# Altium schematic sheet Pedal_Filters.SchDoc
size A2; SheetNumber: 1; SheetTotal: 2
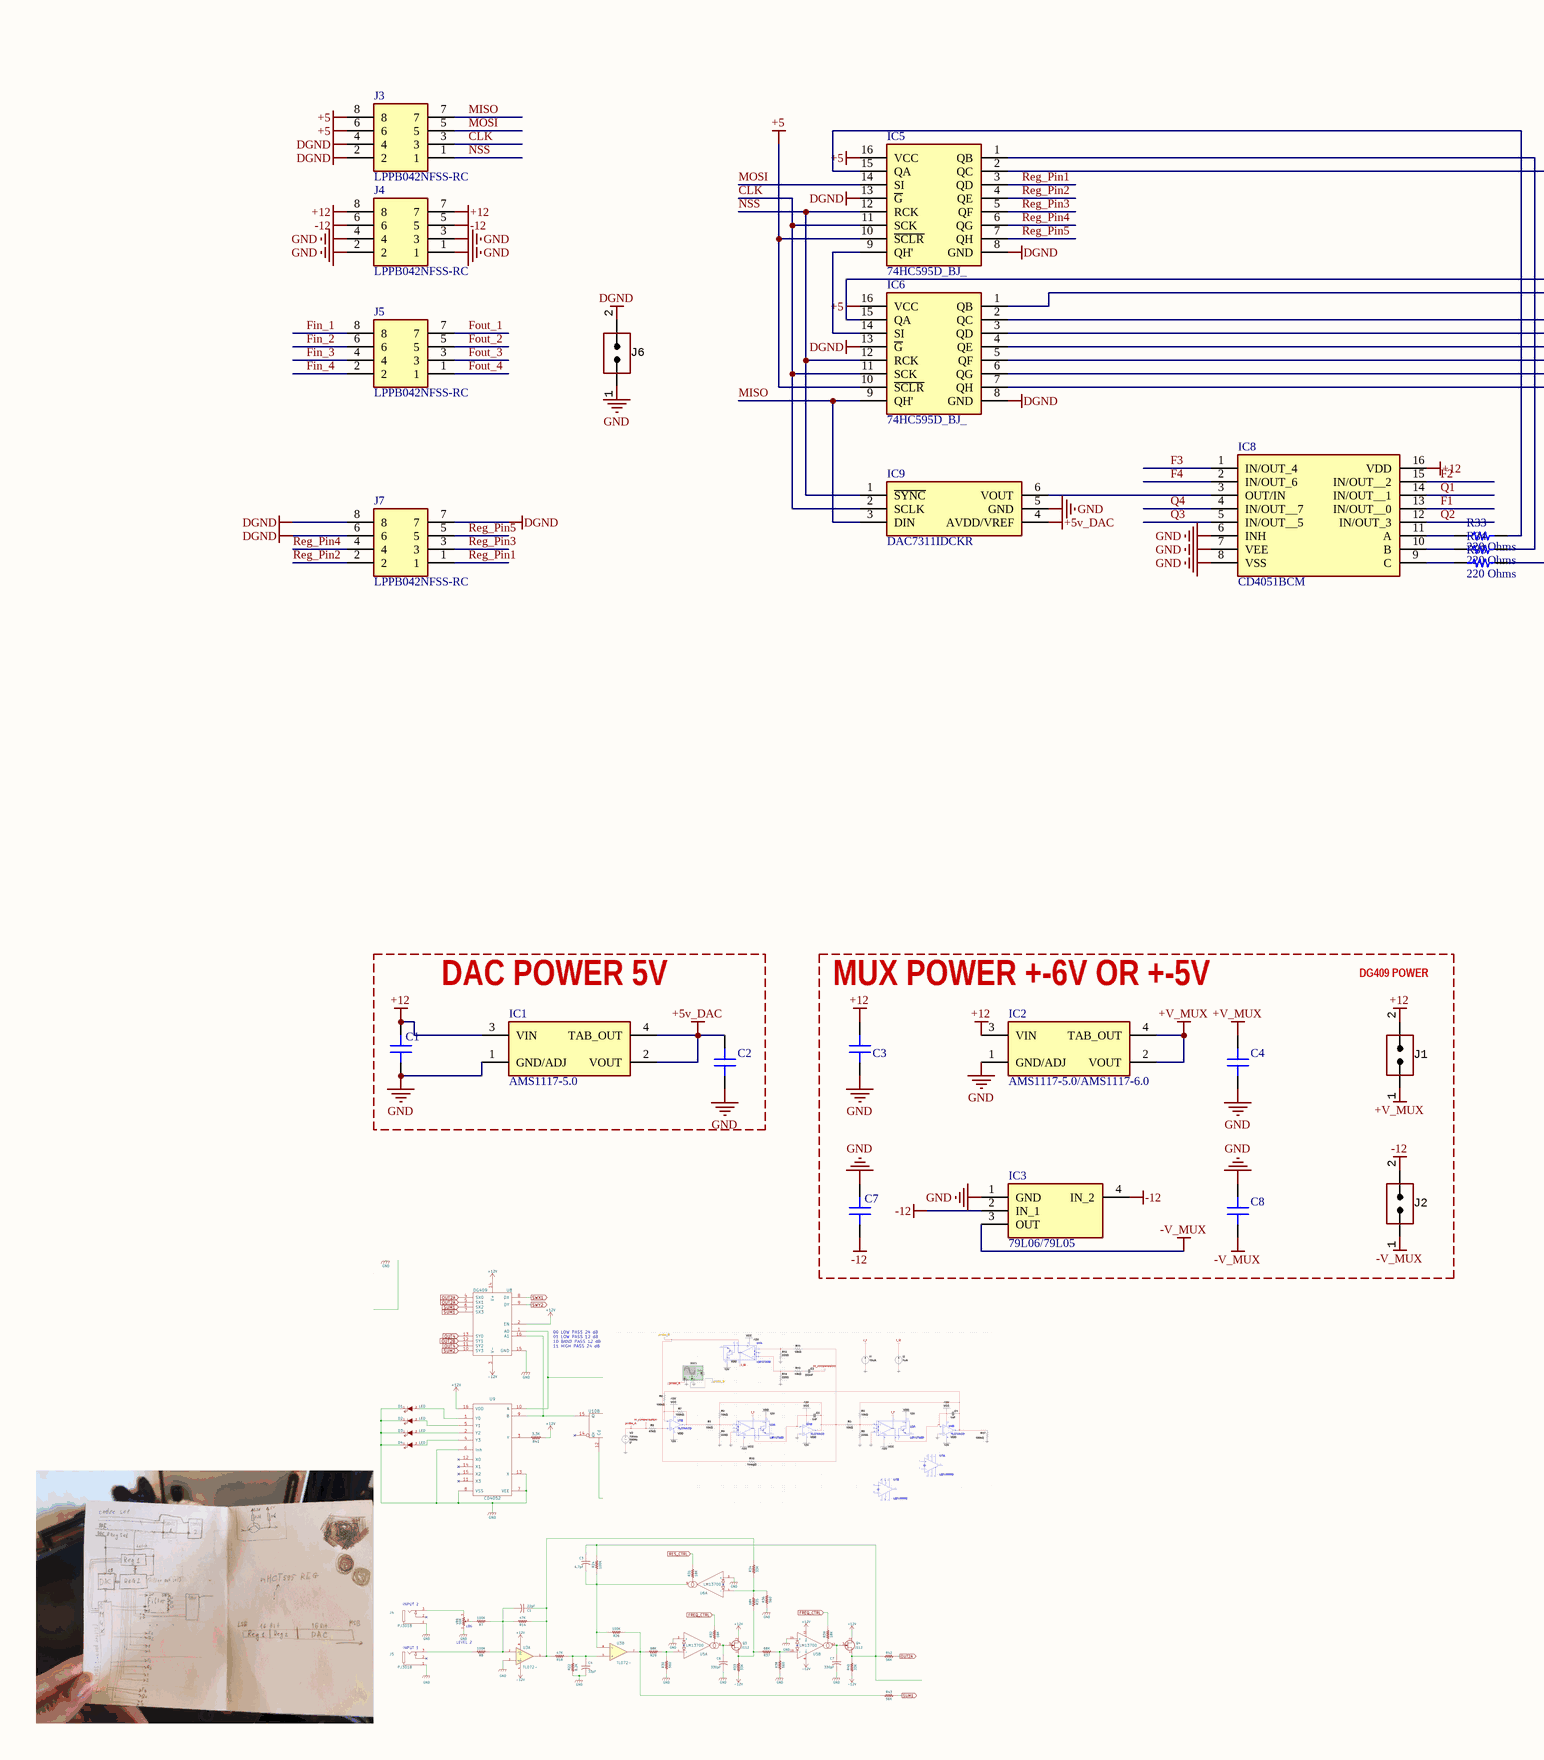
[diagram p0: Pedal_Filters.SchDoc, left]
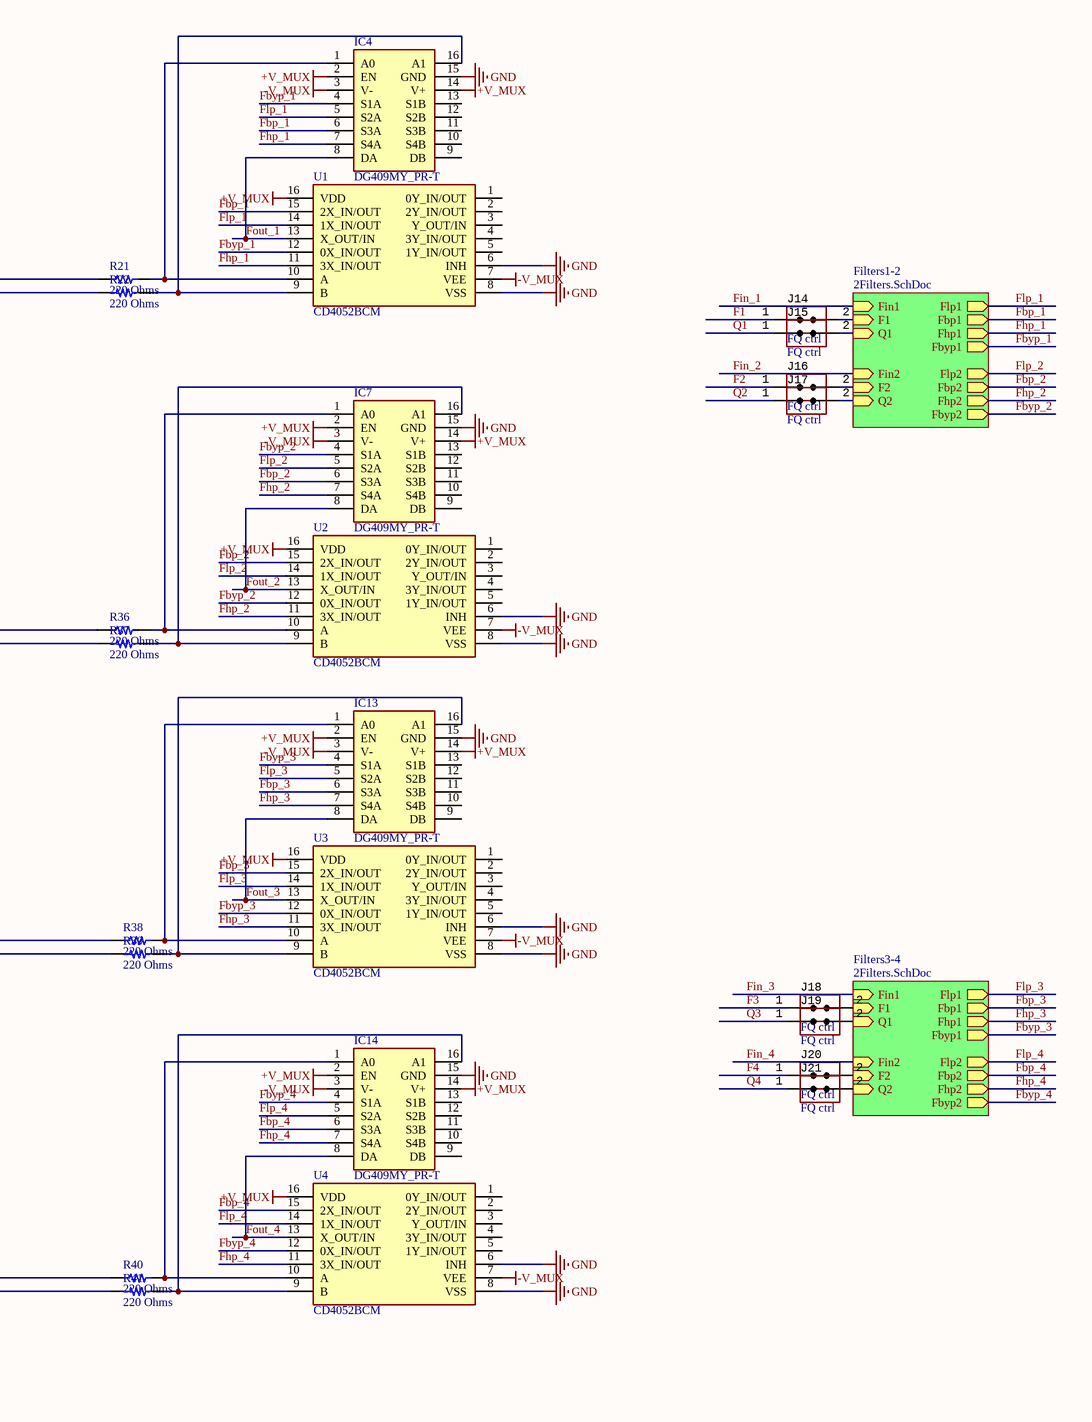
[diagram p1: Pedal_Filters.SchDoc, right]

## Parts
C1  (no value)  [CAP 0805_2012]
C2  (no value)  [CAP 0805_2012]
C3  (no value)  [CAP 0805_2012]
C4  (no value)  [CAP 0805_2012]
C7  (no value)  [CAP 0805_2012]
C8  (no value)  [CAP 0805_2012]
IC1  AMS1117-5.0  [SOT-223]
IC2  AMS1117-5.0/AMS1117-6.0  [SOT-223]
IC3  79L06/79L05  [79L06]
IC4  DG409MY_PR-T  [SOIC127P600X175-16N]
IC5  74HC595D_BJ_  [SOIC127P600X175-16N]
IC6  74HC595D_BJ_  [SOIC127P600X175-16N]
IC7  DG409MY_PR-T  [SOIC127P600X175-16N]
IC8  CD4051BCM  [SOIC127P599X175-16N]
IC9  DAC7311IDCKR  [SOT65P210X110-6N]
IC13  DG409MY_PR-T  [SOIC127P600X175-16N]
IC14  DG409MY_PR-T  [SOIC127P600X175-16N]
J1  V_MUX = 12V  [CON: JUMPER x1]  (value not drawn)
J2  V_MUX = 12V  [CON: JUMPER x1]  (value not drawn)
J3  LPPB042NFSS-RC  [LPPB042NFSSRC]
J4  LPPB042NFSS-RC  [LPPB042NFSSRC]
J5  LPPB042NFSS-RC  [LPPB042NFSSRC]
J6  (no value)  [CON: JUMPER x1]
J7  LPPB042NFSS-RC  [LPPB042NFSSRC]
J14  FQ ctrl  [CON: JUMPER x1]
J15  FQ ctrl  [CON: JUMPER x1]
J16  FQ ctrl  [CON: JUMPER x1]
J17  FQ ctrl  [CON: JUMPER x1]
J18  FQ ctrl  [CON: JUMPER x1]
J19  FQ ctrl  [CON: JUMPER x1]
J20  FQ ctrl  [CON: JUMPER x1]
J21  FQ ctrl  [CON: JUMPER x1]
R21  220 Ohms  [RES 0603_1608]
R22  220 Ohms  [RES 0603_1608]
R33  220 Ohms  [RES 0603_1608]
R34  220 Ohms  [RES 0603_1608]
R35  220 Ohms  [RES 0603_1608]
R36  220 Ohms  [RES 0603_1608]
R37  220 Ohms  [RES 0603_1608]
R38  220 Ohms  [RES 0603_1608]
R39  220 Ohms  [RES 0603_1608]
R40  220 Ohms  [RES 0603_1608]
R41  220 Ohms  [RES 0603_1608]
U1  CD4052BCM  [SOIC127P599X175-16N]
U2  CD4052BCM  [SOIC127P599X175-16N]
U3  CD4052BCM  [SOIC127P599X175-16N]
U4  CD4052BCM  [SOIC127P599X175-16N]

## Blocks framed on the sheet
DAC POWER 5V: C1 C2 IC1
MUX POWER +-6V OR +-5V: C3 C4 C7 C8 IC2 IC3 J1 J2

## Sub-sheets
Filters1-2 = 2Filters.SchDoc: Flp1 (out), Fbp1 (out), Fhp1 (out), Fbyp1 (out), Flp2 (out), Fbp2 (out), Fhp2 (out), Fbyp2 (out), Fin2 (in), Fin1 (in), F1 (in), Q1 (in), F2 (in), Q2 (in)
Filters3-4 = 2Filters.SchDoc: Flp1 (out), Fbp1 (out), Fhp1 (out), Fbyp1 (out), Flp2 (out), Fbp2 (out), Fhp2 (out), Fbyp2 (out), F1 (in), Q1 (in), Fin1 (in), Fin2 (in), F2 (in), Q2 (in)

## Nets
+5: IC5.10(~{SCLR}) IC5.16(VCC) IC6.10(~{SCLR}) IC6.16(VCC) J3.6 J3.8
+5v_DAC: C2.2 IC1.2(VOUT) IC1.4(TAB_OUT) IC9.4(AVDD/VREF)
+12: C1.2 C3.1 IC1.3(VIN) IC2.3(VIN) IC8.16(VDD) J1.2(IN) J4.7 J4.8
+V_MUX: C4.2 IC2.2(VOUT) IC2.4(TAB_OUT) IC4.2(EN) IC4.14(V+) IC7.2(EN) IC7.14(V+) IC13.2(EN) IC13.14(V+) IC14.2(EN) IC14.14(V+) J1.1(IN) U1.16(VDD) U2.16(VDD) U3.16(VDD) U4.16(VDD)
-12: C7.1 IC3.2(IN_1) IC3.4(IN_2) J2.2(IN) J4.5 J4.6
-V_MUX: C8.1 IC3.3(OUT) IC4.3(V-) IC7.3(V-) IC13.3(V-) IC14.3(V-) J2.1(IN) U1.7(VEE) U2.7(VEE) U3.7(VEE) U4.7(VEE)
DGND: IC5.8(GND) IC5.13(~{G}) IC6.8(GND) IC6.13(~{G}) J3.2 J3.4 J6.2(IN) J7.6 J7.7 J7.8
GND: C1.1 C2.1 C3.2 C4.1 C7.2 C8.2 IC1.1(GND/ADJ) IC2.1(GND/ADJ) IC3.1(GND) IC4.15(GND) IC7.15(GND) IC8.6(INH) IC8.7(VEE) IC8.8(VSS) IC9.5(GND) IC13.15(GND) IC14.15(GND) J4.1 J4.2 J4.3 J4.4 J6.1(IN) U1.6(INH) U1.8(VSS) U2.6(INH) U2.8(VSS) U3.6(INH) U3.8(VSS) U4.6(INH) U4.8(VSS)
CLK: IC5.11(SCK) IC6.11(SCK) IC9.2(SCLK) J3.3
F1: IC8.13(IN/OUT__0) J14.1(IN)
F2: IC8.15(IN/OUT__2) J16.1(IN)
F3: IC8.1(IN/OUT_4) J18.1(IN)
F4: IC8.2(IN/OUT_6) J20.1(IN)
Fbp_1: IC4.6(S3A) U1.15(2X_IN/OUT) ; sheet Filters1-2/Fbp1
Fbp_2: IC7.6(S3A) U2.15(2X_IN/OUT) ; sheet Filters1-2/Fbp2
Fbp_3: IC13.6(S3A) U3.15(2X_IN/OUT) ; sheet Filters3-4/Fbp1
Fbp_4: IC14.6(S3A) U4.15(2X_IN/OUT) ; sheet Filters3-4/Fbp2
Fbyp_1: IC4.4(S1A) U1.12(0X_IN/OUT) ; sheet Filters1-2/Fbyp1
Fbyp_2: IC7.4(S1A) U2.12(0X_IN/OUT) ; sheet Filters1-2/Fbyp2
Fbyp_3: IC13.4(S1A) U3.12(0X_IN/OUT) ; sheet Filters3-4/Fbyp1
Fbyp_4: IC14.4(S1A) U4.12(0X_IN/OUT) ; sheet Filters3-4/Fbyp2
Fhp_1: IC4.7(S4A) U1.11(3X_IN/OUT) ; sheet Filters1-2/Fhp1
Fhp_2: IC7.7(S4A) U2.11(3X_IN/OUT) ; sheet Filters1-2/Fhp2
Fhp_3: IC13.7(S4A) U3.11(3X_IN/OUT) ; sheet Filters3-4/Fhp1
Fhp_4: IC14.7(S4A) U4.11(3X_IN/OUT) ; sheet Filters3-4/Fhp2
Fin_1: J5.8 ; sheet Filters1-2/Fin1
Fin_2: J5.6 ; sheet Filters1-2/Fin2
Fin_3: J5.4 ; sheet Filters3-4/Fin1
Fin_4: J5.2 ; sheet Filters3-4/Fin2
Flp_1: IC4.5(S2A) U1.14(1X_IN/OUT) ; sheet Filters1-2/Flp1
Flp_2: IC7.5(S2A) U2.14(1X_IN/OUT) ; sheet Filters1-2/Flp2
Flp_3: IC13.5(S2A) U3.14(1X_IN/OUT) ; sheet Filters3-4/Flp1
Flp_4: IC14.5(S2A) U4.14(1X_IN/OUT) ; sheet Filters3-4/Flp2
Fout_1: IC4.8(DA) J5.7 U1.13(X_OUT/IN)
Fout_2: IC7.8(DA) J5.5 U2.13(X_OUT/IN)
Fout_3: IC13.8(DA) J5.3 U3.13(X_OUT/IN)
Fout_4: IC14.8(DA) J5.1 U4.13(X_OUT/IN)
MISO: IC6.9(QH') IC9.3(DIN) J3.7
MOSI: IC5.14(SI) J3.5
NSS: IC5.12(RCK) IC6.12(RCK) IC9.1(~{SYNC}) J3.1
Q1: IC8.14(IN/OUT__1) J15.1(IN)
Q2: IC8.12(IN/OUT_3) J17.1(IN)
Q3: IC8.5(IN/OUT__5) J19.1(IN)
Q4: IC8.4(IN/OUT__7) J21.1(IN)
Reg_Pin1: IC5.3(QD) J7.1
Reg_Pin2: IC5.4(QE) J7.2
Reg_Pin3: IC5.5(QF) J7.3
Reg_Pin4: IC5.6(QG) J7.4
Reg_Pin5: IC5.7(QH) J7.5
NetIC4_1: IC4.1(A0) R21.1 U1.10(A)
NetIC4_16: IC4.16(A1) R22.1 U1.9(B)
NetIC5_1: IC5.1(QB) R34.1
NetIC5_2: IC5.2(QC) R35.1
NetIC5_9: IC5.9(QH') IC6.14(SI)
NetIC5_15: IC5.15(QA) R33.1
NetIC6_1: IC6.1(QB) R22.2
NetIC6_2: IC6.2(QC) R36.2
NetIC6_3: IC6.3(QD) R37.2
NetIC6_4: IC6.4(QE) R38.2
NetIC6_5: IC6.5(QF) R39.2
NetIC6_6: IC6.6(QG) R40.2
NetIC6_7: IC6.7(QH) R41.2
NetIC6_15: IC6.15(QA) R21.2
NetIC7_1: IC7.1(A0) R36.1 U2.10(A)
NetIC7_16: IC7.16(A1) R37.1 U2.9(B)
NetIC8_3: IC8.3(OUT/IN) IC9.6(VOUT)
NetIC8_9: IC8.9(C) R35.2
NetIC8_10: IC8.10(B) R34.2
NetIC8_11: IC8.11(A) R33.2
NetIC13_1: IC13.1(A0) R38.1 U3.10(A)
NetIC13_16: IC13.16(A1) R39.1 U3.9(B)
NetIC14_1: IC14.1(A0) R40.1 U4.10(A)
NetIC14_16: IC14.16(A1) R41.1 U4.9(B)
NetJ14_2: J14.2(IN) ; sheet Filters1-2/F1
NetJ15_2: J15.2(IN) ; sheet Filters1-2/Q1
NetJ16_2: J16.2(IN) ; sheet Filters1-2/F2
NetJ17_2: J17.2(IN) ; sheet Filters1-2/Q2
NetJ18_2: J18.2(IN) ; sheet Filters3-4/F1
NetJ19_2: J19.2(IN) ; sheet Filters3-4/Q1
NetJ20_2: J20.2(IN) ; sheet Filters3-4/F2
NetJ21_2: J21.2(IN) ; sheet Filters3-4/Q2

Not connected (* = marked no-connect by the designer): IC4 9(DB) 10(S4B) 11(S3B) 12(S2B) 13(S1B); IC7 9(DB) 10(S4B) 11(S3B) 12(S2B) 13(S1B); IC13 9(DB) 10(S4B) 11(S3B) 12(S2B) 13(S1B); IC14 9(DB) 10(S4B) 11(S3B) 12(S2B) 13(S1B); U1 1(0Y_IN/OUT) 2(2Y_IN/OUT) 3(Y_OUT/IN) 4(3Y_IN/OUT) 5(1Y_IN/OUT); U2 1(0Y_IN/OUT) 2(2Y_IN/OUT) 3(Y_OUT/IN) 4(3Y_IN/OUT) 5(1Y_IN/OUT); U3 1(0Y_IN/OUT) 2(2Y_IN/OUT) 3(Y_OUT/IN) 4(3Y_IN/OUT) 5(1Y_IN/OUT); U4 1(0Y_IN/OUT) 2(2Y_IN/OUT) 3(Y_OUT/IN) 4(3Y_IN/OUT) 5(1Y_IN/OUT)

## Notes on the sheet
- DG409 POWER

## Library data of the parts
C1 C3 C7 = EMK212B7105KGHTR: CAP CER 1UF 16V X7R 0805; Capacitance: 1 µF; Part Number: EMK212B7105KGHTR
C2 C4 C8 = LMK212ABJ106KD-T: CAP CER 10UF 10V X5R 0805; Capacitance: 10 µF; Part Number: LMK212ABJ106KD-T
IC1 IC2 = AMS1117-5.0: Integrated Circuit; Manufacturer_Name: Advanced Monolithic Systems; Datasheet Link: http://www.advanced-monolithic.com/pdf/ds1117.pdf; Height: 1.8mm; Manufacturer_Part_Number: AMS1117-5.0
IC3 = 79L06: Integrated Circuit; Manufacturer_Name: MDD; Datasheet Link: https://datasheet.lcsc.com/szlcsc/1909231507_MDD-Microdiode-Electronics-79L06_C414030.pdf; Height: 1.6mm; Manufacturer_Part_Number: 79L06
IC4 IC7 IC13 IC14 = DG409MY_PR-T: Integrated Circuit; Manufacturer_Name: Analog Devices; Manufacturer_Part_Number: DG409MY/PR-T
IC5 IC6 = 74HC595D_BJ_: Integrated Circuit; Manufacturer_Name: Toshiba; Manufacturer_Part_Number: 74HC595D(BJ); Datasheet Link: https://componentsearchengine.com/Datasheets/1/74HC595D(BJ).pdf; Height: 1.75mm; Mouser Part Number: 757-74HC595DBJ; Mouser Price/Stock: https://www.mouser.co.uk/ProductDetail/Toshiba/74HC595DBJ?qs=T%2FywbITssnTkqd02WdSNRg%3D%3D; Arrow Part Number: 74HC595D(BJ); Arrow Price/Stock: https://www.arrow.com/en/products/74hc595d-bj/toshiba?region=nac
IC8 = CD4051BCM: Integrated Circuit; Manufacturer_Name: onsemi; Datasheet Link: https://media.digikey.com/pdf/Data%20Sheets/Fairchild%20PDFs/CD4051BC.pdf; Height: 1.753mm; Manufacturer_Part_Number: CD4051BCM; Mouser Part Number: 512-CD4051BCM; Mouser Price/Stock: https://www.mouser.com/Search/Refine.aspx?Keyword=512-CD4051BCM
IC9 = DAC7311IDCKR: Integrated Circuit; Manufacturer_Name: Texas Instruments; Datasheet Link: https://datasheet.lcsc.com/szlcsc/Texas-Instruments-TI-DAC7311IDCKR_C128601.pdf; Height: 1.1mm; Manufacturer_Part_Number: DAC7311IDCKR; Mouser Part Number: 595-DAC7311IDCKR; Mouser Price/Stock: https://www.mouser.co.uk/ProductDetail/Texas-Instruments/DAC7311IDCKR?qs=z3YOdW4mbAwW%2FH6OJTW4CQ%3D%3D; Arrow Part Number: DAC7311IDCKR; Arrow Price/Stock: https://www.arrow.com/en/products/dac7311idckr/texas-instruments?region=nac
J1 J2 J6 J14-J21 = Jumper_single: CommentText: "Перемычка"
J3-J5 J7 = LPPB042NFSS-RC: Connector; Manufacturer_Name: Sullins; Datasheet Link: https://www.sullinscorp.com/drawings/88_LPPB___2NFSS-RC,_11017.pdf; Height: 4.65mm; Manufacturer_Part_Number: LPPB042NFSS-RC; System: Connector
R21 R22 R33-R41 = CRCW0603220RFKEA: RES SMD 220 OHM 1% 1/10W 0603; Part Number: CRCW0603220RFKEA; Value: 220 Ohms
U1-U4 = CD4052BCM: Undefined or Miscellaneous; Manufacturer_Name: onsemi; Datasheet Link: https://datasheet.datasheetarchive.com/originals/distributors/Datasheets_SAMA/f70c20124315e8f3af2d52f76e34e12a.pdf; Height: 1.753mm; Manufacturer_Part_Number: CD4052BCM; Mouser Part Number: 512-CD4052BCM; Mouser Price/Stock: https://www.mouser.co.uk/ProductDetail/onsemi-Fairchild/CD4052BCM?qs=ZhimqmYZ5InGEAD%2FeTU3GA%3D%3D